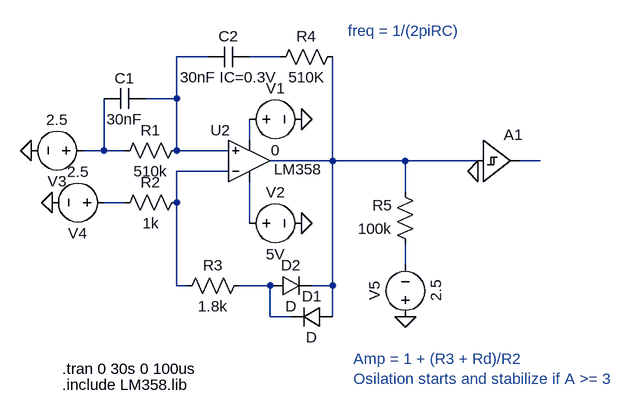
[diagram p0: schematic Wein Bridge Oscillator.asc]
Wein Bridge Oscillator.asc, the LTspice schematic file:
Version 4
SHEET 1 880 680
WIRE 112 -32 64 -32
WIRE 224 -32 176 -32
WIRE 64 32 64 -32
WIRE 64 32 16 32
WIRE 176 96 176 64
WIRE -48 112 -48 32
WIRE -48 112 -80 112
WIRE -16 112 -48 112
WIRE 64 112 64 32
WIRE 144 112 64 112
WIRE 304 128 304 -32
WIRE 304 128 208 128
WIRE 416 128 304 128
WIRE 528 128 416 128
WIRE 624 128 592 128
WIRE 144 144 64 144
WIRE 416 176 416 128
WIRE -16 192 -48 192
WIRE 64 192 64 144
WIRE 176 224 176 160
WIRE 416 288 416 256
WIRE 64 320 64 192
WIRE 80 320 64 320
WIRE 208 320 160 320
WIRE 304 320 304 128
WIRE 304 320 272 320
WIRE 208 368 208 320
WIRE 240 368 208 368
WIRE 304 368 304 320
FLAG 256 64 0
FLAG 256 224 0
FLAG -160 112 0
FLAG -128 192 0
FLAG 416 368 0
FLAG 528 144 0
SYMBOL res 80 96 R90
WINDOW 0 0 56 VBottom 2
WINDOW 3 32 56 VTop 2
SYMATTR InstName R1
SYMATTR Value 510k
SYMBOL res 80 176 R90
WINDOW 0 0 56 VBottom 2
WINDOW 3 32 56 VTop 2
SYMATTR InstName R2
SYMATTR Value 1k
SYMBOL res 176 304 R90
WINDOW 0 0 56 VBottom 2
WINDOW 3 32 56 VTop 2
SYMATTR InstName R3
SYMATTR Value 1.8k
SYMBOL res 320 -48 R90
WINDOW 0 0 56 VBottom 2
WINDOW 3 32 56 VTop 2
SYMATTR InstName R4
SYMATTR Value 510K
SYMBOL res 432 272 R180
WINDOW 0 36 76 Left 2
WINDOW 3 36 40 Left 2
SYMATTR InstName R5
SYMATTR Value 100k
SYMBOL cap 16 16 R90
WINDOW 0 0 32 VBottom 2
WINDOW 3 32 32 VTop 2
SYMATTR InstName C1
SYMATTR Value 30nF
SYMBOL cap 176 -48 R90
WINDOW 0 0 32 VBottom 2
WINDOW 3 32 32 VTop 2
SYMATTR InstName C2
SYMATTR Value 30nF IC=0.3V
SYMBOL voltage 160 64 R270
WINDOW 0 32 56 VTop 2
WINDOW 3 -32 56 VBottom 2
WINDOW 123 0 0 Left 0
WINDOW 39 0 0 Left 0
SYMATTR InstName V1
SYMATTR Value 0
SYMBOL voltage 160 224 R270
WINDOW 0 32 56 VTop 2
WINDOW 3 -32 56 VBottom 2
WINDOW 123 0 0 Left 0
WINDOW 39 0 0 Left 0
SYMATTR InstName V2
SYMATTR Value 5V
SYMBOL diode 304 384 M270
WINDOW 0 32 32 VTop 2
WINDOW 3 0 32 VBottom 2
SYMATTR InstName D1
SYMBOL diode 208 336 R270
WINDOW 0 32 32 VTop 2
WINDOW 3 0 32 VBottom 2
SYMATTR InstName D2
SYMBOL OpAmps\\opamp2 176 192 M180
WINDOW 0 -60 111 Left 2
WINDOW 3 38 51 Left 2
SYMATTR InstName U2
SYMATTR Value LM358
SYMBOL Digital\\schmtbuf 528 64 R0
SYMATTR InstName A1
SYMBOL voltage -64 112 R90
WINDOW 0 32 56 VTop 2
WINDOW 3 -32 56 VBottom 2
WINDOW 123 0 0 Left 0
WINDOW 39 0 0 Left 0
SYMATTR InstName V3
SYMATTR Value 2.5
SYMBOL voltage -32 192 R90
WINDOW 0 32 56 VTop 2
WINDOW 3 -32 56 VBottom 2
WINDOW 123 0 0 Left 0
WINDOW 39 0 0 Left 0
SYMATTR InstName V4
SYMATTR Value 2.5
SYMBOL voltage 416 384 R180
WINDOW 0 32 56 VTop 2
WINDOW 3 -32 56 VBottom 2
WINDOW 123 0 0 Left 0
WINDOW 39 0 0 Left 0
SYMATTR InstName V5
SYMATTR Value 2.5
TEXT -112 448 Left 2 !.tran 0 30s 0 100us
TEXT 336 432 Left 2 ;Amp = 1 + (R3 + Rd)/R2\nOsilation starts and stabilize if A >= 3
TEXT 328 -72 Left 2 ;freq = 1/(2piRC)
TEXT -112 472 Left 2 !.include LM358.lib

The netlist it stands for:
* Wein Bridge Oscillator.asc
R1 N001 N004 510k
R2 N007 N008 1k
R3 N011 N007 1.8k
R4 N005 N002 510K
R5 N010 N005 100k
C1 N001 N004 30nF
C2 N002 N001 30nF IC=0.3V
V1 N003 0 0
V2 N009 0 5V
D1 N005 N011 D
D2 N011 N005 D
XU2 N001 N007 N009 N003 N005 LM358  ; pins In+ In- V+ V- OUT
A1 N005 0 0 0 0 0 N006 0 SCHMITT
V3 N004 0 2.5
V4 N008 0 2.5
V5 0 N010 2.5
.model D D
.lib standard.dio
.tran 0 30s 0 100us
* Amp = 1 + (R3 + Rd)/R2
* Osilation starts and stabilize if A >= 3
* freq = 1/(2piRC)
.include LM358.lib
.backanno
.end